# Altium schematic sheet dac_dac4320_4ch.SchDoc
size A
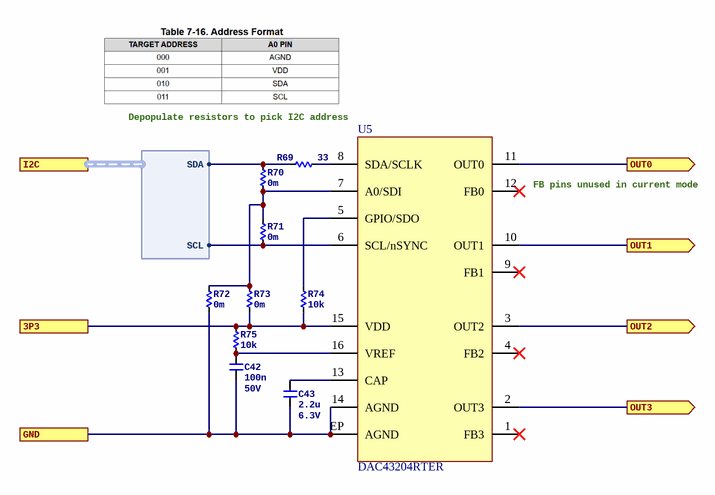
[diagram p0: dac_dac4320_4ch.SchDoc]

## Parts
C42  Capacitance: 100n  Voltage Rating: 50V  [C0402]  (hidden comment: CL05B104KB54PNC)
C43  Capacitance: 2.2u  Voltage Rating: 6.3V  [C0603]  (hidden comment: GCM188R70J225KE22D)
R69  value 33  [R0402]  (hidden comment: CRCW040233R0FKED)
R70  value 0m  [R0402]  (hidden comment: 0402WGF0000TCE)
R71  value 0m  [R0402]  (hidden comment: 0402WGF0000TCE)
R72  value 0m  [R0402]  (hidden comment: 0402WGF0000TCE)
R73  value 0m  [R0402]  (hidden comment: 0402WGF0000TCE)
R74  value 10k  [R0402]  (hidden comment: 0402WGF1002TCE)
R75  value 10k  [R0402]  (hidden comment: 0402WGF1002TCE)
U5  DAC43204RTER  [QFN50P300X300X90-16N]

## Ports
3P3, GND, I2C (harness I2C), OUT0 (out), OUT1 (out), OUT2 (out), OUT3 (out)

## Harnesses
I2C: SCL, SDA

## Nets
3P3: R73.1 R74.2 R75.2 U5.15(VDD) ; port 3P3
GND: C42.2 C43.2 R72.1 U5.14(AGND) U5.EP(AGND) ; port GND
OUT0: U5.11(OUT0) ; port OUT0
OUT1: U5.10(OUT1) ; port OUT1
OUT2: U5.3(OUT2) ; port OUT2
OUT3: U5.2(OUT3) ; port OUT3
NetC42_1: C42.1 R75.1 U5.16(VREF)
NetC43_1: C43.1 U5.13(CAP)
NetR69_1: R69.1 U5.8(SDA/SCLK)
NetR69_2: R69.2 R70.2 ; port I2C.SDA
NetR70_1: R70.1 R71.2 R72.2 R73.2 U5.7(A0/SDI)
NetR71_1: R71.1 U5.6(SCL/nSYNC) ; port I2C.SCL
NetR74_1: R74.1 U5.5(GPIO/SDO)

Not connected (* = marked no-connect by the designer): U5 1(FB3)* 4(FB2)* 9(FB1)* 12(FB0)*

## Notes on the sheet
- Depopulate resistors to pick I2C address
- (near U5) FB pins unused in current mode

## Library data of the parts
C42 = CL05B104KB54PNC: Manufacturer: Samsung Electro-Mechanics; Dielectric: X7R; ComponentLink1URL: https://wmsc.lcsc.com/wmsc/upload/file/pdf/v2/lcsc/2304140030_Samsung-Electro-Mechanics-CL05B104KB54PNC_C307331.pdf; ComponentLink1Description: Datasheet; Manufacturer Part Number: CL05B104KB54PNC; Package: 0402; Supplier 2: LCSC; Supplier Part Number 2: C307331
C43 = GCM188R70J225KE22D: Manufacturer: Murata Electronics; Dielectric: X7R; ComponentLink1URL: https://wmsc.lcsc.com/wmsc/upload/file/pdf/v2/lcsc/1810311130_Murata-Electronics-GCM188R70J225KE22D_C126582.pdf; ComponentLink1Description: Datasheet; Manufacturer Part Number: GCM188R70J225KE22D; Package: 0603; Supplier 2: LCSC; Supplier Part Number 2: C126582
R69 = CRCW040233R0FKED: Manufacturer: Vishay Intertech; Tolerance: 1%; Temperature Coefficient: Â±100ppm/â„ƒ; Power Rating (mW): 63; ComponentLink1Description: Datasheet; ComponentLink1URL: https://wmsc.lcsc.com/wmsc/upload/file/pdf/v2/lcsc/2304140030_Vishay-Intertech-CRCW040233R0FKED_C242490.pdf; Manufacturer Part Number: CRCW040233R0FKED; Package: 0402; Supplier 2: LCSC; Supplier Part Number 2: C242490
R70-R73 = 0402WGF0000TCE: Manufacturer: UNI-ROYAL(Uniroyal Elec); Power Rating (mW): 62.5; ComponentLink1Description: Datasheet; ComponentLink1URL: https://wmsc.lcsc.com/wmsc/upload/file/pdf/v2/lcsc/2206010216_UNI-ROYAL-Uniroyal-Elec-0402WGF0000TCE_C17168.pdf; Manufacturer Part Number: 0402WGF0000TCE; Package: 0402; Supplier 2: LCSC; Supplier Part Number 2: C17168
R74 R75 = 0402WGF1002TCE: Manufacturer: UNI-ROYAL(Uniroyal Elec); Tolerance: 1%; Temperature Coefficient: Â±100ppm/â„ƒ; Power Rating (mW): 62.5; Manufacturer Part Number: 0402WGF1002TCE; ComponentLink1Description: Datasheet; ComponentLink1URL: https://wmsc.lcsc.com/wmsc/upload/file/pdf/v2/lcsc/2206010100_UNI-ROYAL-Uniroyal-Elec-0402WGF1002TCE_C25744.pdf; Package: 0402; Supplier 2: LCSC; Supplier Part Number 2: C25744
U5 = DAC_DAC43204RTER: IC DAC 8BIT V OR A-OUT 16WQFN; Manufacturer: Texas Instruments; Manufacturer Part Number: DAC43204RTER; Supplier 1: Digi-Key; Supplier Part Number: 296-DAC43204RTERTR-ND; ComponentLink1Description: Datasheet; ComponentLink1URL: https://www.ti.com/lit/ds/symlink/dac43204.pdf; Supplier 2: LCSC; Supplier Part Number 2: C5215475